# EAGLE design alps-skc-1 (EAGLE 6.4)
AUTHOR_NAME: kps; PROJECT_NAME: Keyswitch breakout; VERSION: 20130907
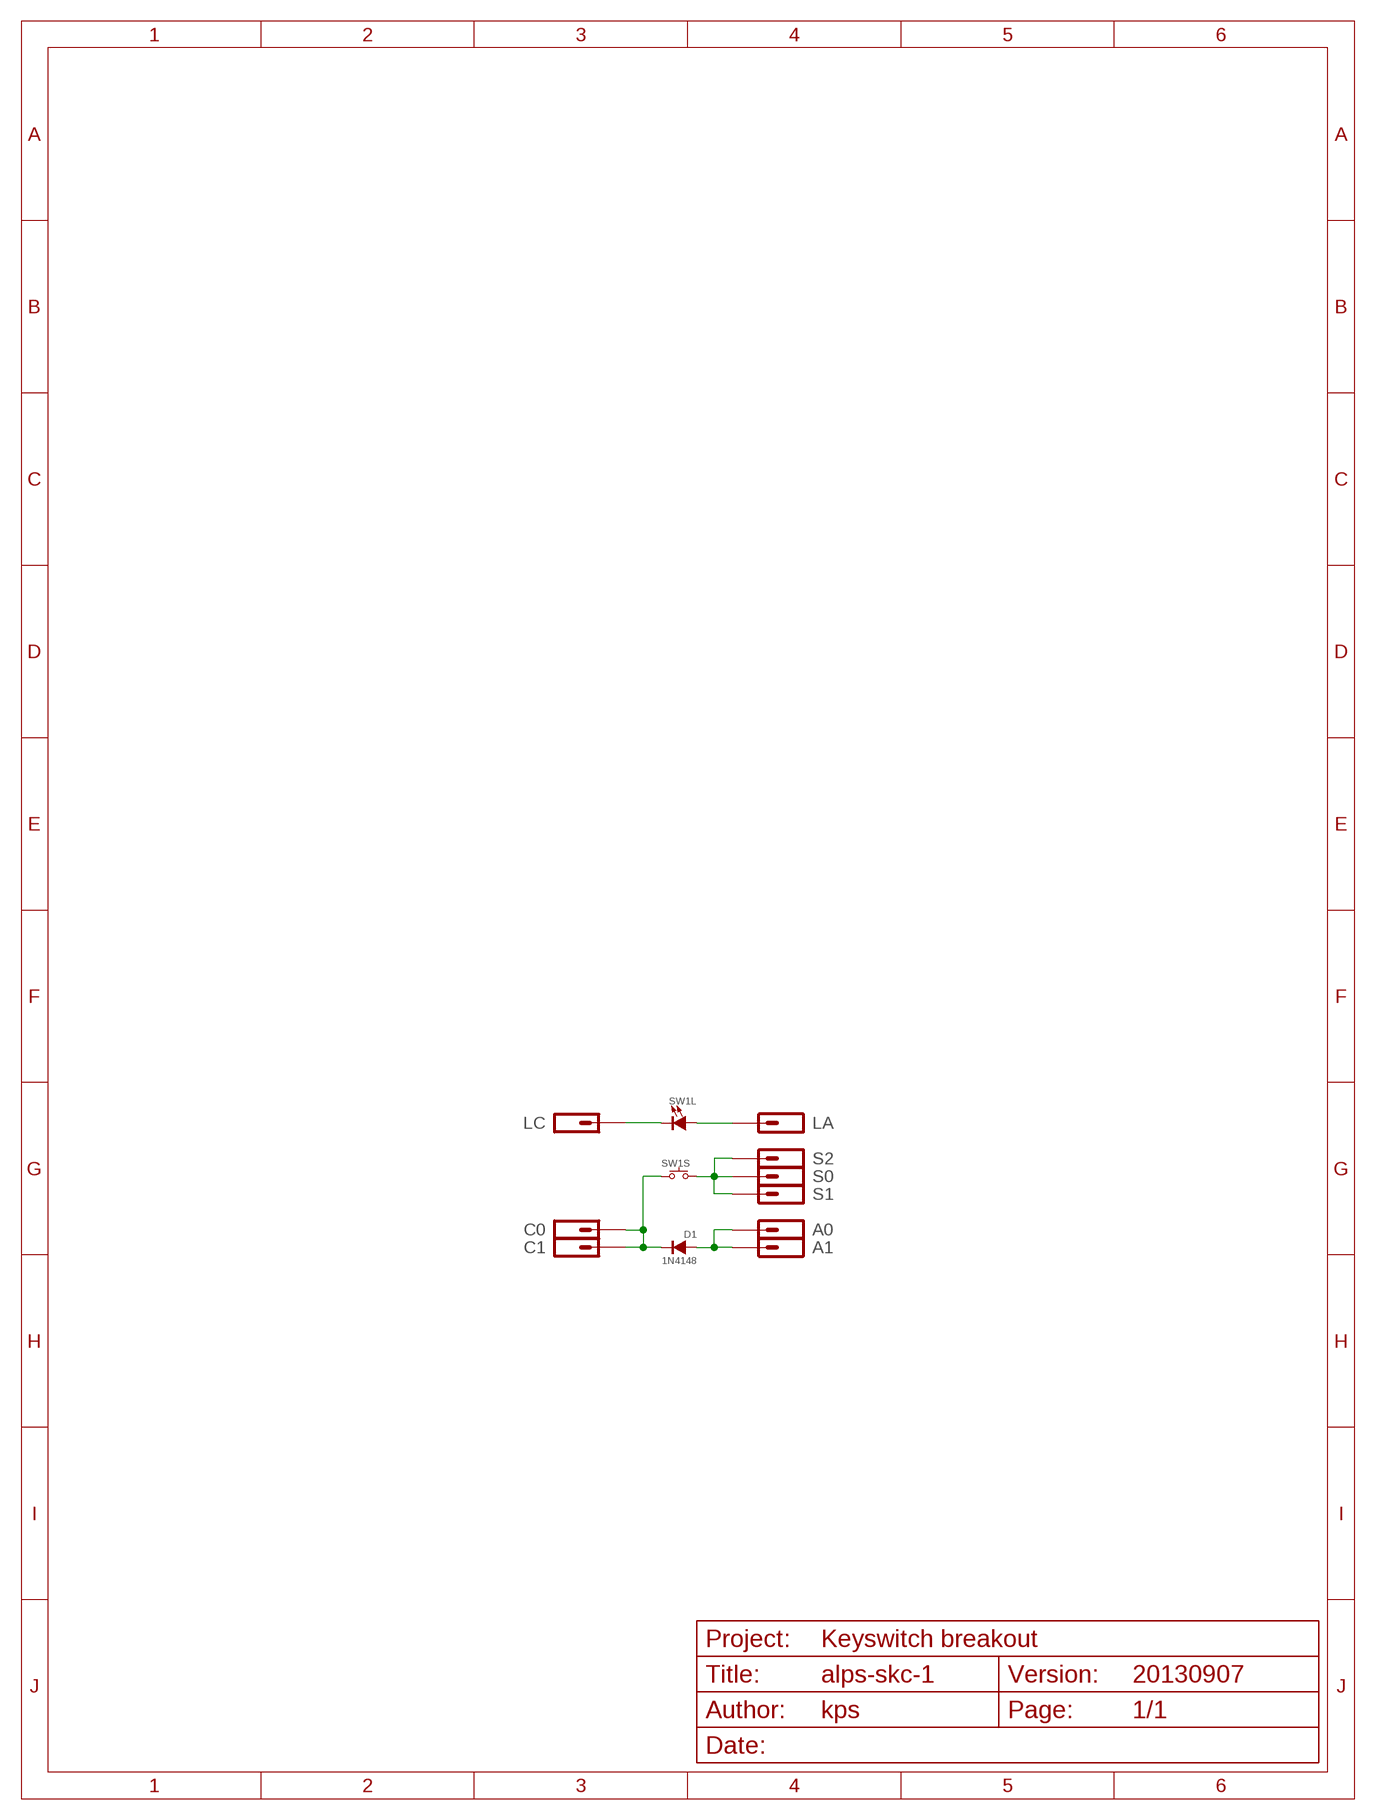
[diagram p0: schematic, sheet 1]

## Parts
A0  J-1-SQUARE-70  [J-1-SQUARE-70]
A1  J-1-SQUARE-74  [J-1-SQUARE-74]
C0  J-1-SQUARE-70  [J-1-SQUARE-70]
C1  J-1-SQUARE-74  [J-1-SQUARE-74]
D1  1N4148  DIODE-SMA+SOD323-NOSS  [SMA+SOD323-P-NOSS]
LA  J-1-OCTAGON-70  [J-1-OCTAGON-70]
LC  J-1-OCTAGON-70  [J-1-OCTAGON-70]
S0  J-1-ROUND-70  [J-1-ROUND-70]
S1  J-1-ROUND-74  [J-1-ROUND-74]
S2  J-1-ROUND-74  [J-1-ROUND-74]
SW1  SW-ALPS-SKC-LED  [SW-ALPS-SKC-LED]

## Nets
A: A0.1 A1.1 D1.A
C: C0.1 C1.1 D1.C SW1.S1
LA: LA.1 SW1.LA(L:A)
LC: LC.1 SW1.LC(L:C)
S: S0.1 S1.1 S2.1 SW1.S2

## Library data of the parts
A0 A1 C0 C1 LA LC S0 S1 S2 = conn:J-1: 1 pin connector
D1 = misc:DIODE
SW1 = switch:SW-ALPS-SKC-LED: ALPS SKB/SKC keyswitch, with LED

## Board
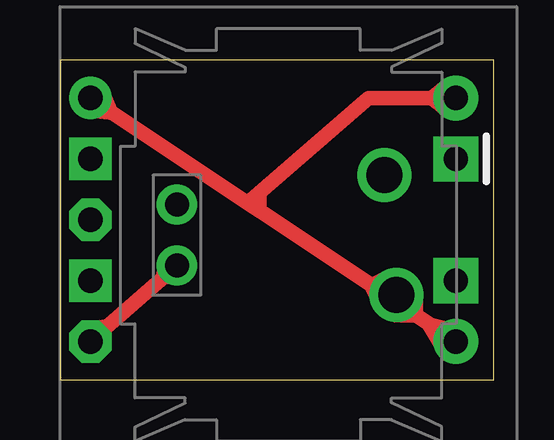
[diagram p1: board, top side]
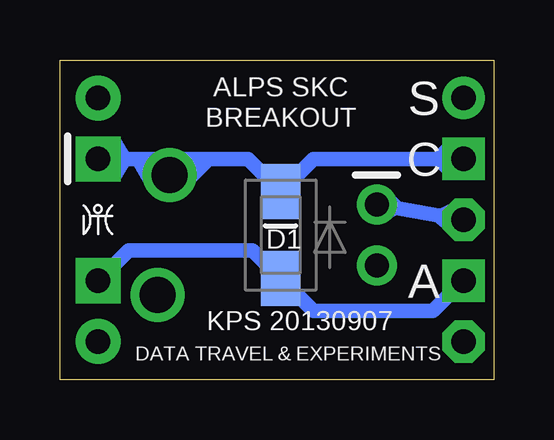
[diagram p2: board, bottom side, seen from below]

Size 18.1 x 13.33 mm. Coordinates in mm from the lower left corner, seen from the top.
Outline: 0,0 18.1,0 18.1,13.33 0,13.33 0,0
Copper layers (1*16): Top 0.0356mm / dielectric 1.5011mm / Bottom 0.0356mm
Design rules "LaenPCBOrder": minimum track width 6mil, minimum drill 13mil, track to track 6mil, track to pad 6mil, pad to pad 6mil, via to via 6mil, smd to smd 6mil, copper to edge 15mil, drill to drill 6mil, minimum pad ring 7mil, minimum via ring 7mil, stop-mask expansion 4mil, vias tented up to drill 0mil, thermal gap 10mil

### Footprints (pad centres in the part's own frame; a part is rotated, then mirrored left to right if it is on the bottom)
J-1-SQUARE-70 = drill 1.016 pad 1.778 square: 1 0,0
J-1-SQUARE-74 = drill 1.016 pad 1.88 square: 1 0,0
SMA+SOD323-P-NOSS = smd 2.286 x 1.651: A -1.816,0; C 1.816,0
J-1-OCTAGON-70 = drill 1.016 pad 1.778 octagon: 1 0,0
J-1-ROUND-70 = drill 1.016 pad 1.778: 1 0,0
J-1-ROUND-74 = drill 1.016 pad 1.88: 1 0,0
SW-ALPS-SKC-LED = drill 1 pad 1.676: LA 1.27,-4.65; LC -1.27,-4.65 | drill 1.5: S1 -2.5,4; S2 2.5,4.5

### Placement (x,y rotation side)
A0  1.27,4.13 0 top
A1  16.51,4.13 0 top
C0  1.27,9.21 0 top
C1  16.51,9.21 0 top
D1  8.89,6.03 90 bottom
LA  1.27,1.59 0 top
LC  1.27,6.67 0 top
S0  1.27,11.75 0 top
S1  16.51,11.75 0 top
S2  16.51,1.59 0 top
SW1  9.53,6.03 270 top
U$1  [GLYPH-DT&E-50]  16.51,6.67 0 bottom

### Tracks (layer width: path | path; a pad name or v marks a point on that pad's centre or on a via)
A
  Bottom 0.61: A0.1 2.54,2.86 7.53,2.86 D1.A 10.07,5.4 15.24,5.4 A1.1
C
  Bottom 0.305: 1.91,9.84 2.54,9.21 1.91,8.57 | 15.72,10 15.24,9.21 15.72,8.41
  Bottom 0.61: C1.1 15.24,9.21 14.84,9.21 | 14.84,9.21 14.29,8.25 14.29,8.53 SW1.S1 12.74,8.37 11.91,9.21 | C0.1 2.54,9.21 7.53,9.21 D1.C 10.25,9.21 11.91,9.21 | 11.91,9.21 14.84,9.21
LA
  Top 0.305: 1.11,2.06 LA.1
  Top 0.61: LA.1 SW1.LA | 1.11,2.06 1.91,2.22 1.75,1.27
LC
  Bottom 0.305: 1.59,6.03 2.54,6.83 2.54,6.99 | LC.1 2.54,6.99 | 2.54,6.99 2.22,6.99 1.59,7.3
  Bottom 0.61: LC.1 SW1.LC
N$1
  Bottom 0.305: 4.6,7.94 3.81,7.14 4.76,6.67
N$2
  Top 0.305: 4.29,5.08 4.13,4.13 4.92,4.13
S
  Top 0.305: 16.03,12.38 15.24,11.75 16.03,11.11 | 13.18,3.18 12.7,4.13 13.34,4.13 13.97,3.49 13.97,3.81 13.49,4.29 | 13.97,2.54 14.61,2.54 | 14.61,2.54 15.08,2.54 | 16.03,0.95 15.08,2.54 | 15.08,2.54 16.99,2.06 | 0.95,11.11 2.38,10.95 1.91,12.07 1.59,12.07 S0.1 | 14.92,2.7 14.76,2.7 14.61,2.54
  Top 0.406: 8.41,7.94 8.41,6.99 | 13.49,4.29 12.86,3.97 | 14.92,3.49 14.92,2.7
  Top 0.61: S0.1 7.83,7.38 | 7.83,7.38 8.41,6.99 12.7,4.13 13.87,3.35 | 13.87,3.35 15.08,2.54 S2.1 | SW1.S2 13.87,3.35 | S1.1 15.24,11.75 12.86,11.75 7.83,7.38

### Text on the board
bPlace: ALPS SKC | S | BREAKOUT | C | A | KPS 20130907 | EXPERIMENTS | & | DATA TRAVEL